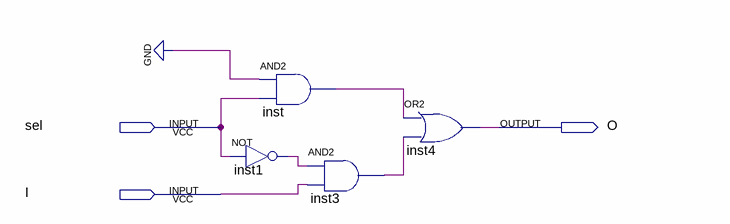
[diagram p0: schematic sheet]
// Quartus schematic FlushMux1bit.bdf as structural Verilog: 4 symbols, 3 pins
module FlushMux1bit (
  input  sel,
  input  I,
  output O
);

  wire inst1_out, inst3_out, inst_out;

  and inst (inst_out, 1'b0, sel);
  not inst1 (inst1_out, sel);
  and inst3 (inst3_out, inst1_out, I);
  or inst4 (O, inst_out, inst3_out);
endmodule
